# EAGLE schematic clk_gate (EAGLE 9.6.2)
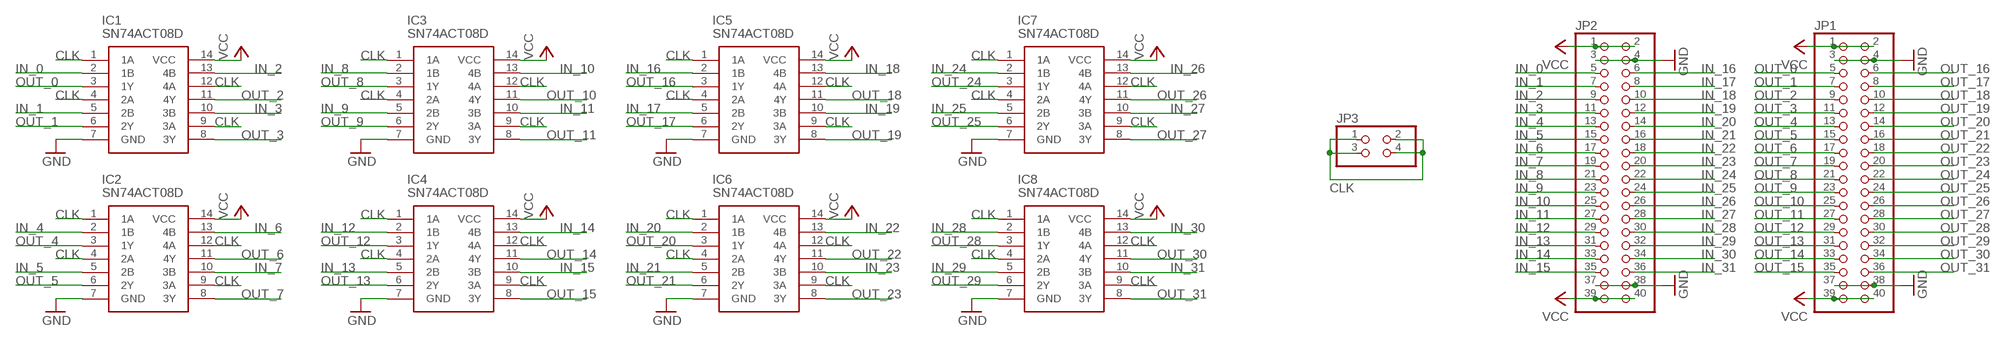
[diagram p0: schematic, sheet 1]

## Parts
IC1  SN74ACT08D  [SOIC127P600X175-14N]
IC2  SN74ACT08D  [SOIC127P600X175-14N]
IC3  SN74ACT08D  [SOIC127P600X175-14N]
IC4  SN74ACT08D  [SOIC127P600X175-14N]
IC5  SN74ACT08D  [SOIC127P600X175-14N]
IC6  SN74ACT08D  [SOIC127P600X175-14N]
IC7  SN74ACT08D  [SOIC127P600X175-14N]
IC8  SN74ACT08D  [SOIC127P600X175-14N]
JP1  PINHD-2X20  [2X20]
JP2  PINHD-2X20  [2X20]
JP3  PINHD-2X2  [2X02]

## Nets
CLK: IC1.1(1A) IC1.4(2A) IC1.9(3A) IC1.12(4A) IC2.1(1A) IC2.4(2A) IC2.9(3A) IC2.12(4A) IC3.1(1A) IC3.4(2A) IC3.9(3A) IC3.12(4A) IC4.1(1A) IC4.4(2A) IC4.9(3A) IC4.12(4A) IC5.1(1A) IC5.4(2A) IC5.9(3A) IC5.12(4A) IC6.1(1A) IC6.4(2A) IC6.9(3A) IC6.12(4A) IC7.1(1A) IC7.4(2A) IC7.9(3A) IC7.12(4A) IC8.1(1A) IC8.4(2A) IC8.9(3A) IC8.12(4A) JP3.1 JP3.2 JP3.3 JP3.4
GND: IC1.7(GND) IC2.7(GND) IC3.7(GND) IC4.7(GND) IC5.7(GND) IC6.7(GND) IC7.7(GND) IC8.7(GND) JP1.3 JP1.4 JP1.37 JP1.38 JP2.3 JP2.4 JP2.37 JP2.38
IN_0: IC1.2(1B) JP2.5
IN_1: IC1.5(2B) JP2.7
IN_2: IC1.13(4B) JP2.9
IN_3: IC1.10(3B) JP2.11
IN_4: IC2.2(1B) JP2.13
IN_5: IC2.5(2B) JP2.15
IN_6: IC2.13(4B) JP2.17
IN_7: IC2.10(3B) JP2.19
IN_8: IC3.2(1B) JP2.21
IN_9: IC3.5(2B) JP2.23
IN_10: IC3.13(4B) JP2.25
IN_11: IC3.10(3B) JP2.27
IN_12: IC4.2(1B) JP2.29
IN_13: IC4.5(2B) JP2.31
IN_14: IC4.13(4B) JP2.33
IN_15: IC4.10(3B) JP2.35
IN_16: IC5.2(1B) JP2.6
IN_17: IC5.5(2B) JP2.8
IN_18: IC5.13(4B) JP2.10
IN_19: IC5.10(3B) JP2.12
IN_20: IC6.2(1B) JP2.14
IN_21: IC6.5(2B) JP2.16
IN_22: IC6.13(4B) JP2.18
IN_23: IC6.10(3B) JP2.20
IN_24: IC7.2(1B) JP2.22
IN_25: IC7.5(2B) JP2.24
IN_26: IC7.13(4B) JP2.26
IN_27: IC7.10(3B) JP2.28
IN_28: IC8.2(1B) JP2.30
IN_29: IC8.5(2B) JP2.32
IN_30: IC8.13(4B) JP2.34
IN_31: IC8.10(3B) JP2.36
OUT_0: IC1.3(1Y) JP1.5
OUT_1: IC1.6(2Y) JP1.7
OUT_2: IC1.11(4Y) JP1.9
OUT_3: IC1.8(3Y) JP1.11
OUT_4: IC2.3(1Y) JP1.13
OUT_5: IC2.6(2Y) JP1.15
OUT_6: IC2.11(4Y) JP1.17
OUT_7: IC2.8(3Y) JP1.19
OUT_8: IC3.3(1Y) JP1.21
OUT_9: IC3.6(2Y) JP1.23
OUT_10: IC3.11(4Y) JP1.25
OUT_11: IC3.8(3Y) JP1.27
OUT_12: IC4.3(1Y) JP1.29
OUT_13: IC4.6(2Y) JP1.31
OUT_14: IC4.11(4Y) JP1.33
OUT_15: IC4.8(3Y) JP1.35
OUT_16: IC5.3(1Y) JP1.6
OUT_17: IC5.6(2Y) JP1.8
OUT_18: IC5.11(4Y) JP1.10
OUT_19: IC5.8(3Y) JP1.12
OUT_20: IC6.3(1Y) JP1.14
OUT_21: IC6.6(2Y) JP1.16
OUT_22: IC6.11(4Y) JP1.18
OUT_23: IC6.8(3Y) JP1.20
OUT_24: IC7.3(1Y) JP1.22
OUT_25: IC7.6(2Y) JP1.24
OUT_26: IC7.11(4Y) JP1.26
OUT_27: IC7.8(3Y) JP1.28
OUT_28: IC8.3(1Y) JP1.30
OUT_29: IC8.6(2Y) JP1.32
OUT_30: IC8.11(4Y) JP1.34
OUT_31: IC8.8(3Y) JP1.36
VCC: IC1.14(VCC) IC2.14(VCC) IC3.14(VCC) IC4.14(VCC) IC5.14(VCC) IC6.14(VCC) IC7.14(VCC) IC8.14(VCC) JP1.1 JP1.2 JP1.39 JP1.40 JP2.1 JP2.2 JP2.39 JP2.40

## Library data of the parts
IC1-IC8 = SN74ACT08D:SN74ACT08D: Texas Instruments SN74ACT08D, AND Quad 2 Input AND, 4.5 5.5 V, 14-Pin SOIC Source: Datasheet <http://www.ti.com/lit/gpn/sn74act08>; ARROW_PART_NUMBER: SN74ACT08D; ARROW_PRICE-STOCK: https://www.arrow.com/en/products/sn74act08d/texas-instruments; DESCRIPTION: Texas Instruments SN74ACT08D, AND Quad 2 Input AND, 4.5 5.5 V, 14-Pin SOIC; HEIGHT: mm; MANUFACTURER_NAME: Texas Instruments; MANUFACTURER_PART_NUMBER: SN74ACT08D; MOUSER_PART_NUMBER: 595-SN74ACT08D; MOUSER_PRICE-STOCK: https://www.mouser.co.uk/ProductDetail/Texas-Instruments/SN74ACT08D?qs=d9gICRQKuCebaEBMy8%2FRJw%3D%3D
JP1 JP2 = pinhead:PINHD-2X20: PIN HEADER
JP3 = pinhead:PINHD-2X2: PIN HEADER